# EAGLE design PiPowerRF (EAGLE 7.2.0)
CNAME: Arcturus Designs; CREVISION: 1.0; DESIGNER: Prajwal Bhattaram
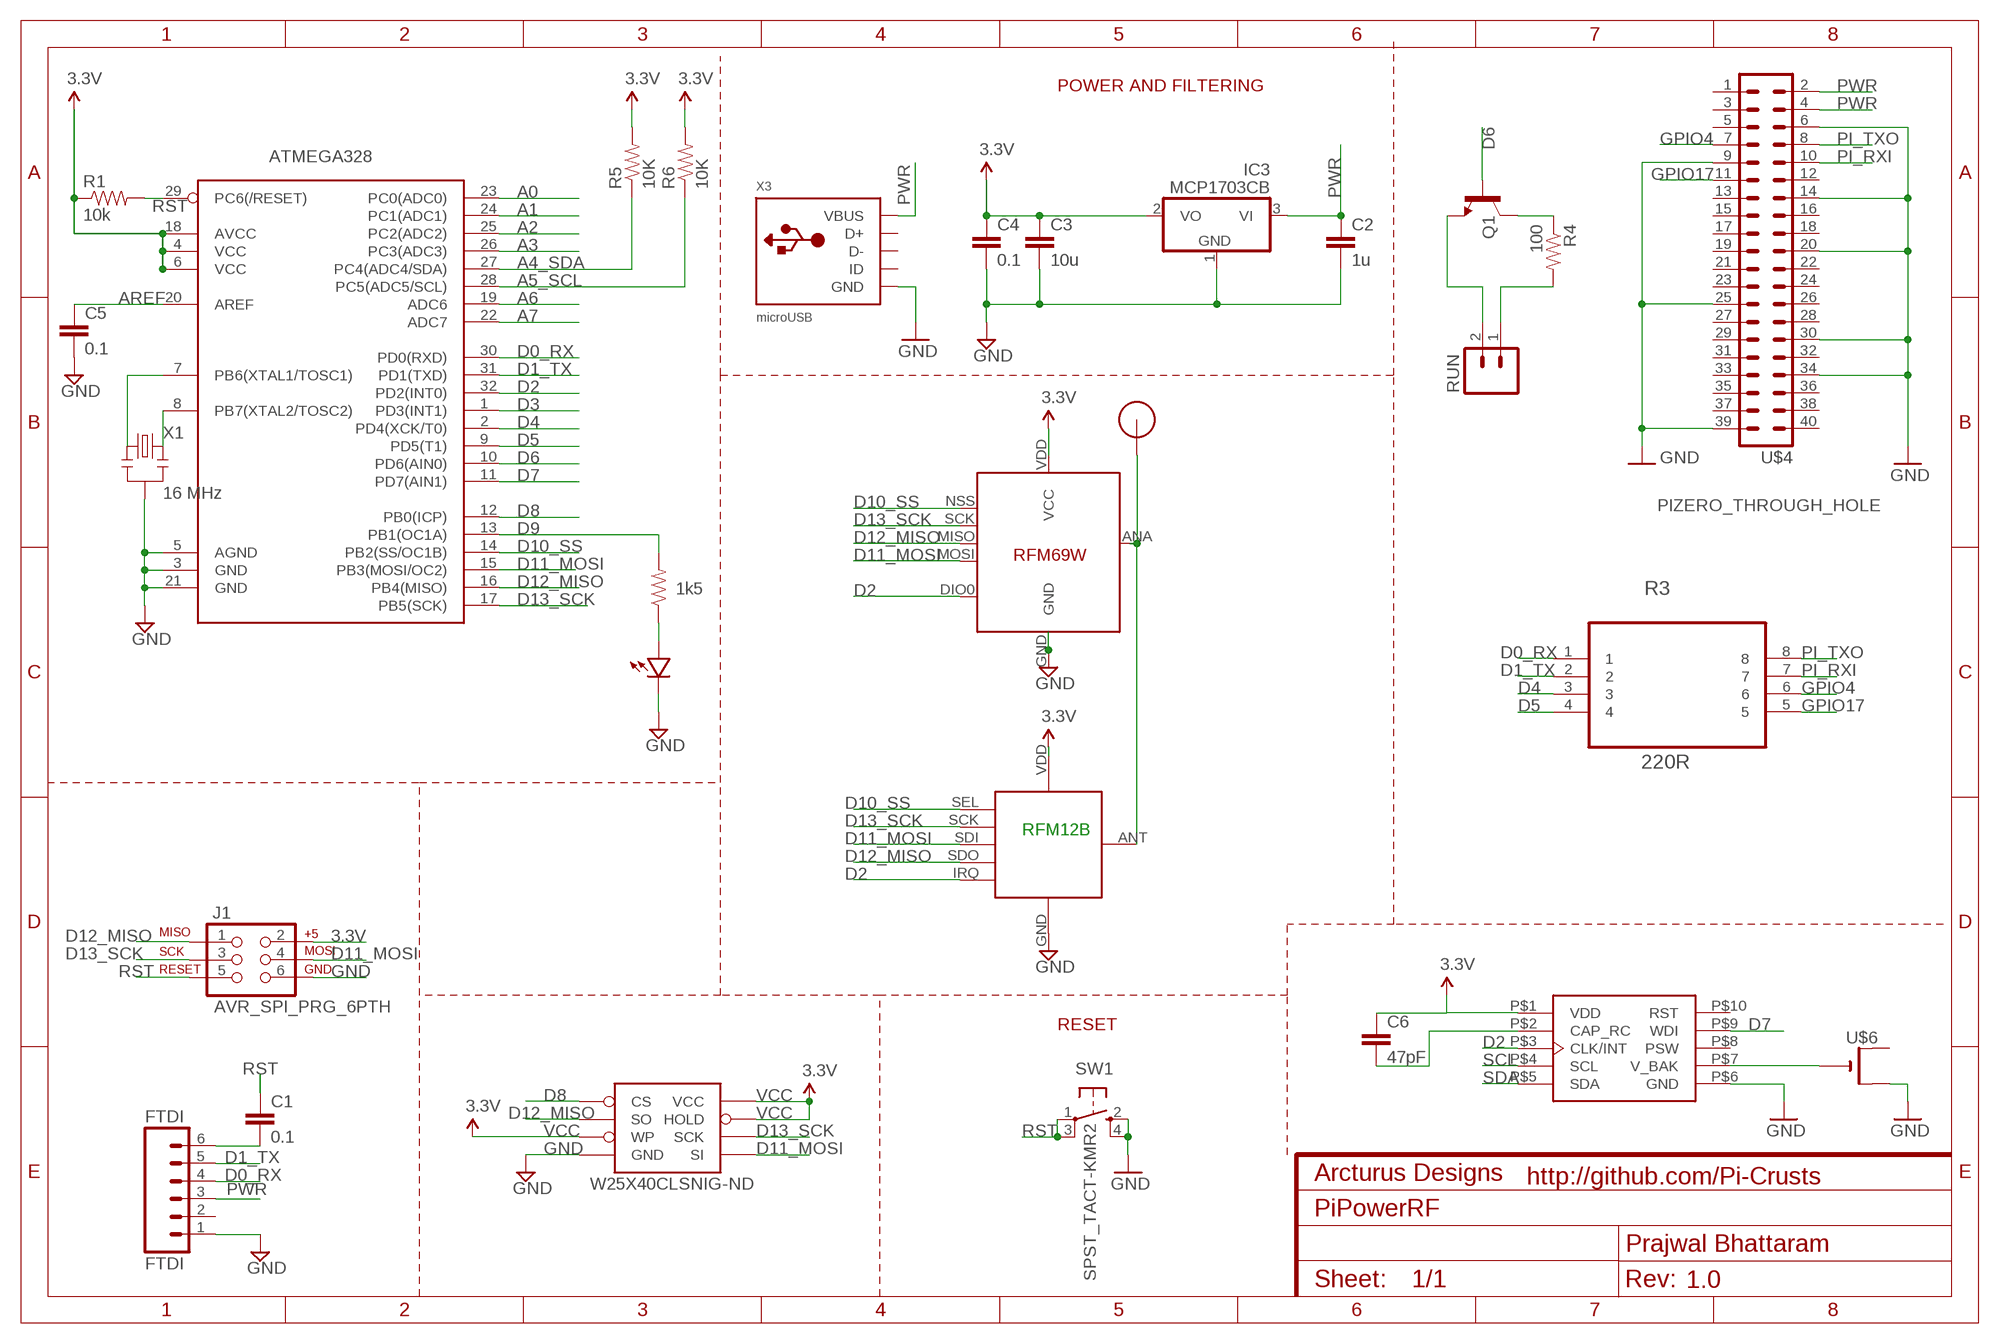
[diagram p0: schematic, sheet 1]

## Parts
ATMEGA328  ATMega-328  ATMEGA168/328TQFP32  [TQFP32-08]
C1  0.1  CAP0603-CAP  [0603-CAP]
C2  1u  CAP0603-CAP  [0603-CAP]
C3  10u  CAP0805-CAP  [0805-CAP]
C4  0.1  CAP0603-CAP  [0603-CAP]
C5  0.1  CAP0603-CAP  [0603-CAP]
C6  47pF  CAP0402-CAP  [0402-CAP]
FTDI  FTDI  M06SIP  [1X06]
IC3  MCP1703CB  [SOT23]
J1  AVR_SPI_PRG_6PTH  [2X3]
Q1  MMBT2222A  TRANSISTOR_NPNMMBT2222A  [SOT23-3]
R1  10k  RESISTOR0603-RES  [0603-RES]
R2  1k5  RESISTOR0603-RES  [0603-RES]
R3  220R  EXB38V221JV  [RESCAXE80P320X160X60-8N]
R4  100  RESISTOR0402-RES  [0402-RES]
R5  10K  RESISTOR0603  [0603-RES]
R6  10K  RESISTOR0603  [0603-RES]
RFM12B  RFM12B_MINPADS  [RFM12B-MINPADS]
RUN  M021X02_NO_SILK  [1X02_NO_SILK]
SW1  SPST_TACT-KMR2  [KMR2]
U$1  RFM12B_ANTENNA  [RFM12B-ANTENNA]
U$2  LED0603  [0603-LED]
U$4  PIZERO_THROUGH_HOLE  [PIZERO_THOUGH_HOLE]
U$5  RFM69  [RFM69W-MINPADS]
U$6  CR1220SMT  [CR1220-SMD]
W25X40CLSNIG-ND  AT25F512BWIDE_5.3MM  [SO08WIDE]
X1  16 MHz  RESONATORSMD  [RESONATOR-SMD]
X2  MC-RTC-RV-1805-C3-I2C  [MC-RTC-C3]
X3  microUSB  USB_MICRO_20329_V2  [4UCONN_20329_V2]

## Nets
3.3V: J1.2
A0: ATMEGA328.23(PC0(ADC0))
A1: ATMEGA328.24(PC1(ADC1))
A2: ATMEGA328.25(PC2(ADC2))
A3: ATMEGA328.26(PC3(ADC3))
A4_SDA: ATMEGA328.27(PC4(ADC4/SDA)) R5.1
A5_SCL: ATMEGA328.28(PC5(ADC5/SCL)) R6.1
A6: ATMEGA328.19(ADC6)
A7: ATMEGA328.22(ADC7)
AREF: ATMEGA328.20(AREF) C5.1
D0_RX: ATMEGA328.30(PD0(RXD)) FTDI.4 R3.1
D1_TX: ATMEGA328.31(PD1(TXD)) FTDI.5 R3.2
D2: ATMEGA328.32(PD2(INT0)) RFM12B.IRQ U$5.DIO0 X2.P$3(CLK/INT)
D3: ATMEGA328.1(PD3(INT1))
D4: ATMEGA328.2(PD4(XCK/T0)) R3.3
D5: ATMEGA328.9(PD5(T1)) R3.4
D6: ATMEGA328.10(PD6(AIN0)) Q1.1(B)
D7: ATMEGA328.11(PD7(AIN1)) X2.P$9(WDI)
D8: ATMEGA328.12(PB0(ICP)) W25X40CLSNIG-ND.1(CS)
D9: ATMEGA328.13(PB1(OC1A)) R2.2
D10_SS: ATMEGA328.14(PB2(SS/OC1B)) RFM12B.SEL U$5.NSS(SEL)
D11_MOSI: ATMEGA328.15(PB3(MOSI/OC2)) J1.4 RFM12B.SDI(SDI/MOSI) U$5.MOSI W25X40CLSNIG-ND.5(SI)
D12_MISO: ATMEGA328.16(PB4(MISO)) J1.1 RFM12B.SDO(SDO/MISO) U$5.MISO W25X40CLSNIG-ND.2(SO)
D13_SCK: ATMEGA328.17(PB5(SCK)) J1.3 RFM12B.SCK U$5.SCK W25X40CLSNIG-ND.6(SCK)
GND [power]: ATMEGA328.3(GND) ATMEGA328.5(AGND) ATMEGA328.21(GND) C2.2 C3.2 C4.2 C5.2 FTDI.1 IC3.1(GND) J1.6 RFM12B.GND SW1.2(S) SW1.4(S1) U$2.MINUS U$4.6 U$4.9 U$4.14 U$4.20 U$4.25 U$4.30 U$4.34 U$4.39 U$5.GND U$6.+$2(+1) W25X40CLSNIG-ND.4(GND) X1.2 X2.P$6(GND) X3.BASE@1(GND) X3.BASE@2(GND) X3.GND X3.SPRT@1(GND) X3.SPRT@2(GND) X3.SPRT@3(GND) X3.SPRT@4(GND)
GPIO4: R3.6 U$4.7
GPIO17: R3.5 U$4.11
N$1: ATMEGA328.7(PB6(XTAL1/TOSC1)) X1.1
N$2: R2.1 U$2.PLUS
N$3: RFM12B.ANT U$1.P$1 U$5.ANA(ANT)
N$4: R4.2 RUN.1
N$5: Q1.2(E) RUN.2
N$6: U$6.- X2.P$7(V_BAK)
N$7: Q1.3(C) R4.1
N$8: C6.2 X2.P$2(CAP_RC)
N$20: C1.2 FTDI.6
N$21: ATMEGA328.8(PB7(XTAL2/TOSC2)) X1.3
PI_RXI: R3.7 U$4.10
PI_TXO: R3.8 U$4.8
PWR [power]: C2.1 FTDI.3 IC3.3(VI) U$4.2 U$4.4 X3.VBUS
RST: ATMEGA328.29(PC6(/RESET)) C1.1 J1.5 R1.2 SW1.1(P) SW1.3(P1)
SCL: X2.P$4(SCL)
SDA: X2.P$5(SDA)
VCC: ATMEGA328.4(VCC) ATMEGA328.6(VCC) ATMEGA328.18(AVCC) C3.1 C4.1 C6.1 IC3.2(VO) R1.1 R5.2 R6.2 RFM12B.VDD U$5.VDD(VCC) W25X40CLSNIG-ND.3(WP) W25X40CLSNIG-ND.7(HOLD) W25X40CLSNIG-ND.8(VCC) X2.P$1(VDD) ; supply symbol labelled 3.3V
Unconnected: FTDI.2 U$4.1 U$4.3 U$4.5 U$4.12 U$4.13 U$4.15 U$4.16 U$4.17 U$4.18 U$4.19 U$4.21 U$4.22 U$4.23 U$4.24 U$4.26 U$4.27 U$4.28 U$4.29 U$4.31 U$4.32 U$4.33 U$4.35 U$4.36 U$4.37 U$4.38 U$4.40 U$6.+$1(+) X2.P$8(PSW) X2.P$10(RST) X3.D+ X3.D- X3.ID

## Notes on the sheet
- POWER AND FILTERING
- RFM12B
- RESET
- http://github.com/Pi-Crusts

## Library data of the parts
ATMEGA328 = LowPowerLab:ATMEGA168/328: Atmel 32-pin 8-bit micro, 16k flash.
C1-C5 = LowPowerLab:CAP: Capacitor Standard 0603 ceramic capacitor, and 0.1" leaded capacitor.
C6 = SparkFun-Capacitors:CAP: Capacitor Standard 0603 ceramic capacitor, and 0.1" leaded capacitor.
FTDI = SparkFun-Connectors:M06: Header 6 Standard 6-pin 0.1" header. Use with straight break away headers (SKU : PRT-00116), right angle break away headers (PRT-00553), swiss pins (PRT-00743), machine pins (PRT-00117), and female headers (PRT-00115). Molex polarized connector foot print use with SKU : PRT-08094 with associated crimp pins and housings. NOTES ON THE VARIANTS LOCK and LOCK_LONGPADS... This footprint was designed to help hold the alignment of a through-hole component (i.e. 6-pin header) while soldering it into place. You may notice that each hole has been shifted either up or down by 0.005 of an inch from it's more standard position (which is a perfectly straight line). This slight alteration caused the pins (the squares in the middle) to touch the edges of the holes. Because they are alternating, it causes a "brace" to hold the component in place. 0.005 has proven to be the perfect amount of "off-center" position when using our standard breakaway headers. Although looks a little odd when you look at the bare footprint, once you have a header in there, the alteration is very hard to notice. Also, if you push a header all the way into place, it is covered up entirely on the bottom side. This idea of altering the position of holes to aid alignment will be further integrated into the Sparkfun Library for other footprints. It can help hold any component with 3 or more connection pins.
IC3 = linear:MCP1703: 250 mA, 16V, Low Quiescent Current LDO Regulator Source: http://ww1.microchip.com/downloads/en/DeviceDoc/22049b.pdf
J1 = SparkFun-Connectors:AVR_SPI_PRG_6: AVR ISP 6 Pin This is the reduced ISP connector for AVR programming. Common on Arduino. This footprint will take up less PCB space and can be used with a 10-pin to 6-pin adapter such as SKU: BOB-08508
Q1 = SparkFun-DiscreteSemi:TRANSISTOR_NPN: Generic NPN BJT MMBT2222A - TRANS-08049 (SOT-23, 1A 40V) MPSA42 - TRANS-09116 (SOT-23, 500mA 300V) MMBT5088LT1G - TRANS-11160 (SOT-23, 50 mA 30V); PROD_ID: TRANS-08049
R1 R2 = LowPowerLab:RESISTOR: Resistor Basic schematic elements and footprints for 0603, 1206, and PTH resistors.
R3 = Panasonic-EXB-ERJ:EXB38V: Chip Resistor Array; MPN: EXB38V221JV; OC_FARNELL: 2060094; OC_NEWARK: 65T9093; PACKAGE: 0603; POWERRATING: 0.063 W/element; SUPPLIER: PANASONIC; TOLERANCE: ±5 %
R4 = SparkFun-Passives:RESISTOR: Resistor Basic schematic elements and footprints for 0603, 1206, and PTH resistors.
R5 R6 = SparkFun-Resistors:RESISTOR: Resistor Basic schematic elements and footprints for 0603, 1206, and PTH resistors.
RFM12B = LowPowerLab:RFM12B_MINPADS
RUN = SparkFun-Connectors:M02: Standard 2-pin 0.1" header. Use with - straight break away headers ( PRT-00116) - right angle break away headers (PRT-00553) - swiss pins (PRT-00743) - machine pins (PRT-00117) - female headers (PRT-00115) Molex polarized connector foot print use with: PRT-08233 with associated crimp pins and housings. 2.54_SCREWTERM for use with PRT-10571. 3.5mm Screw Terminal footprints for PRT-08084 5mm Screw Terminal footprints for use with PRT-08433
SW1 = adafruit:SPST_TACT: SMT 6mm switch, EVQQ2 series http://www.ladyada.net/library/eagle
U$1 = LowPowerLab:RFM12B_ANTENNA
U$2 = LowPowerLab:LED
U$4 = pizero:PIZERO_THROUGH_HOLE
U$5 = LowPowerLab:RFM69
U$6 = adafruit:CR1220: CR1216/CR1220/CR1225 12mm 3V lithium coin cell Great for battery packup. Both SMT and THM holders. Note the THM package has the ground pads on both sides of the PCB so that the masks are the same - this reduces the cost
W25X40CLSNIG-ND = LowPowerLab:AT25F512B: 4-Mbit SPI flash memory
X1 = SparkFun:RESONATOR: Resonator Small SMD resonator. This is the itty bitty 10/20MHz resonators with built in caps. CSTCE10M0G55 and CSTCE20M0V53. Footprint has been reviewed closely but hasn't been tested yet.
X2 = Microcrystal-RTC:MC-RTC-RV-1805-C3-I2C: MicroCrystal RV-1805-C3 Extreme Low Power RTC Module Extreme Low Current consumption XTAL-Mode 60nA RC-Mode 17nA RC Autocalibrated Mode 22nA Factory calibrated Time accuracy typ. ±2.0ppm @ 25°C Miniature SMT ceramic package with integrated Quartz Crystal for best Noise & EMI Immunity Automatic Battery Switchover, Trickle Charger, Power Management & Power Switch Function Programmable CLKOUT frequencies I2C Bus Interface (fast mode 400kHz) Time keeping mode down to 1.5 V Programmable Alarm, Timer and INT 512 Bytes of User RAM
X3 = microbuilder:USB: USB Connectors USBMINIB - Surface Mount Female Mini-B USB Connector 4UConnector: 06564

## Net classes
1 power: width 0.381 mm, clearance 0.254 mm

## Board
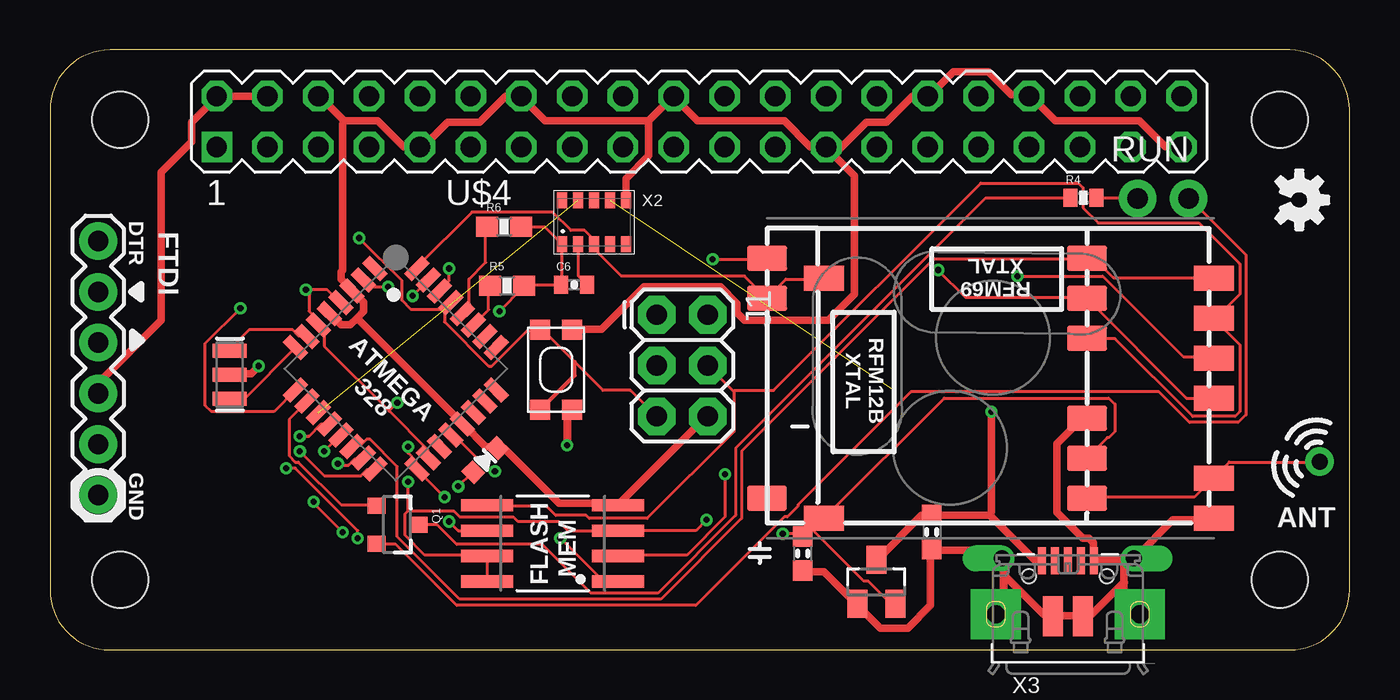
[diagram p1: board, top side]
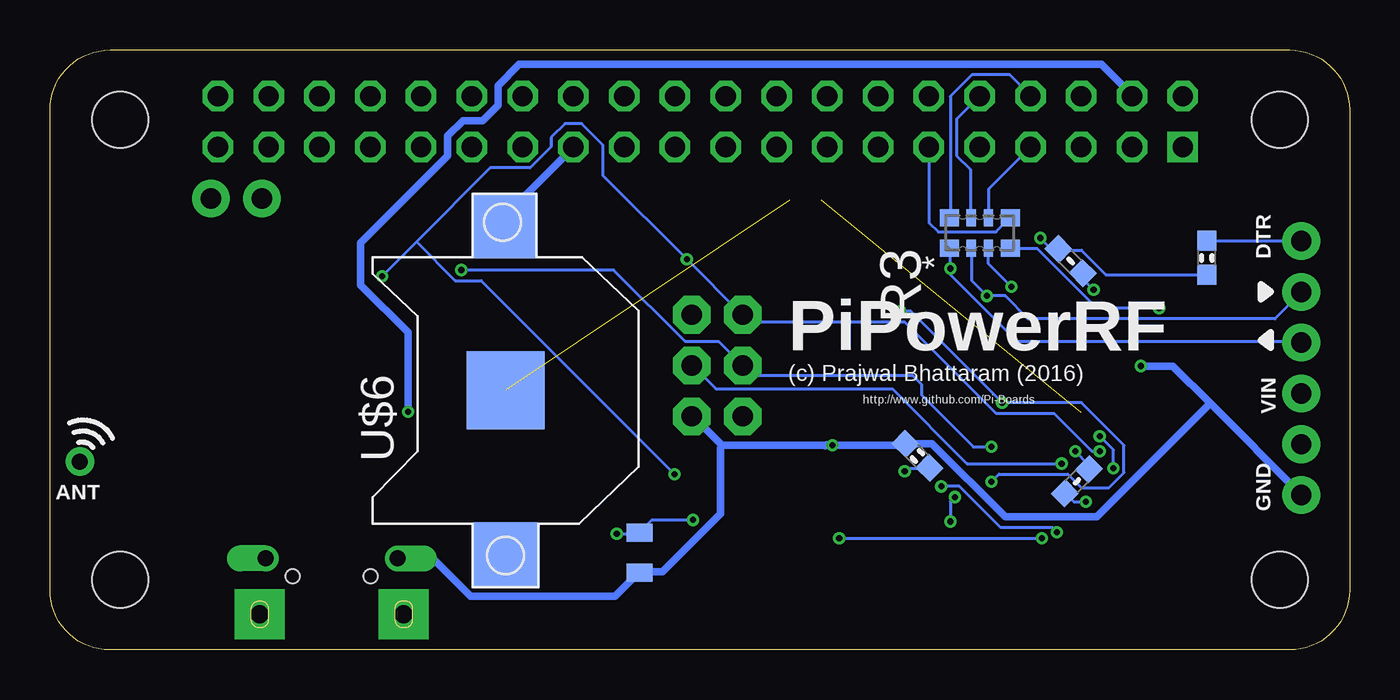
[diagram p2: board, bottom side, seen from below]

Size 65 x 30 mm. Coordinates in mm from the lower left corner, seen from the top.
Copper layers (1*16): Top 0.035mm / dielectric 1.5mm / Bottom 0.035mm
Design rules "ITEADstudio_DRC *": minimum track width 6mil, minimum drill 12mil, track to track 6mil, track to pad 6mil, pad to pad 6mil, via to via 6mil, smd to smd 0mil, copper to edge 10mil, drill to drill 10mil, minimum pad ring 10mil, minimum via ring 6mil, stop-mask expansion 2mil, vias tented up to drill 100mil, thermal gap 15mil
tRestrict: area 24.2,8.9 to 29,12.9; area 5.8,16.9 to 6.8,18.6; area 5.1,9.7 to 6.7,10.4
bRestrict: area 27.4,17.7 to 29.1,18.7; area 21,13.9 to 22.8,14.9; area 21.5,12.6 to 22,13.2; area 20.6,12.6 to 21.1,13.2; area 20.1,12.9 to 20.6,13.5; area 20,13.4 to 20.5,14.1; area 26.5,18.9 to 27,19.5; area 26.5,17.9 to 27,18.5; area 27.5,19.2 to 28,19.8; area 27.9,18.8 to 29,19.6

### Footprints (pad centres in the part's own frame; a part is rotated, then mirrored left to right if it is on the bottom)
TQFP32-08 = smd 1.27 x 0.533: 1 -4.293,2.8; 2 -4.293,2; 3 -4.293,1.2; 4 -4.293,0.4; 5 -4.293,-0.4; 6 -4.293,-1.2; 7 -4.293,-2; 8 -4.293,-2.8; 17 4.293,-2.8; 18 4.293,-2; 19 4.293,-1.2; 20 4.293,-0.4; 21 4.293,0.4; 22 4.293,1.2; 23 4.293,2; 24 4.293,2.8 | smd 0.533 x 1.27: 9 -2.8,-4.293; 10 -2,-4.293; 11 -1.2,-4.293; 12 -0.4,-4.293; 13 0.4,-4.293; 14 1.2,-4.293; 15 2,-4.293; 16 2.8,-4.293; 25 2.8,4.293; 26 2,4.293; 27 1.2,4.293; 28 0.4,4.293; 29 -0.4,4.293; 30 -1.2,4.293; 31 -2,4.293; 32 -2.8,4.293
0603-CAP = smd 1.016 x 0.965: 1 -0.85,0; 2 0.85,0
0805-CAP = smd 0.902 x 1.3: 1 -1,0; 2 1,0
0402-CAP = smd 0.7 x 0.9: 1 -0.65,0; 2 0.65,0
1X06 = drill 1.016 pad 1.88: 1 0,0; 2 2.54,0; 3 5.08,0; 4 7.62,0; 5 10.16,0; 6 12.7,0
SOT23 = smd 1 x 1.4: 1 -0.95,-1.1; 2 0.95,-1.1; 3 0,1.1
2X3 = drill 1.016 pad 1.88 octagon: 1 0,0; 2 0,2.54; 3 2.54,0; 4 2.54,2.54; 5 5.08,0; 6 5.08,2.54
SOT23-3 = smd 0.8 x 0.9: 1 -0.95,-1; 2 0.95,-1; 3 0,1.1
0603-RES = smd 1.016 x 0.965: 1 -0.85,0; 2 0.85,0
RESCAXE80P320X160X60-8N = smd 0.864 x 0.965: 1 -0.762,1.524; 4 -0.762,-1.524; 5 0.762,-1.524; 8 0.762,1.524 | smd 0.864 x 0.457: 2 -0.762,0.432; 3 -0.762,-0.432; 6 0.762,-0.432; 7 0.762,0.432
0402-RES = smd 0.7 x 0.9: 1 -0.65,0; 2 0.65,0
0603-RES' = smd 1.1 x 1: 1 -0.85,0; 2 0.85,0
RFM12B-MINPADS = smd 2 x 1.27: ANT 8,-6; GND 8,-2; IRQ -8,4; SCK 8,4; SDI 8,2; SDI1 -8.002,-6.001; SDO -8,6; SEL 8,6; VDD 8,-4
1X02_NO_SILK = drill 1.016 pad 1.88: 1 0,0; 2 2.54,0
KMR2 = smd 1 x 1: 1 2,0.8; 2 2,-0.8; 3 -2,0.8; 4 -2,-0.8
RFM12B-ANTENNA = drill 0.8 pad 1.422: P$1 0,0
0603-LED = smd 0.8 x 0.9: MINUS -0.85,0; PLUS 0.85,0
PIZERO_THOUGH_HOLE = drill 1.016 square: 1 8.34,25.15 | drill 1.016 octagon: 2 8.34,27.69; 3 10.88,25.15; 4 10.88,27.69; 5 13.42,25.15; 6 13.42,27.69; 7 15.96,25.15; 8 15.96,27.69; 9 18.5,25.15; 10 18.5,27.69; 11 21.04,25.15; 12 21.04,27.69; 13 23.58,25.15; 14 23.58,27.69; 15 26.12,25.15; 16 26.12,27.69; 17 28.66,25.15; 18 28.66,27.69; 19 31.2,25.15; 20 31.2,27.69; 21 33.74,25.15; 22 33.74,27.69; 23 36.28,25.15; 24 36.28,27.69; 25 38.82,25.15; 26 38.82,27.69; 27 41.36,25.15; 28 41.36,27.69; 29 43.9,25.15; 30 43.9,27.69; 31 46.44,25.15; 32 46.44,27.69; 33 48.98,25.15; 34 48.98,27.69; 35 51.52,25.15; 36 51.52,27.69; 37 54.06,25.15; 38 54.06,27.69; 39 56.6,25.15; 40 56.6,27.69 | hole 2.8: 3.5,3.5; 3.5,26.5; 61.5,26.5; 61.5,3.5
RFM69W-MINPADS = smd 2 x 1.27: ANA 8,-5; DIO0 -11.5,5; GND 8,-7; MISO 8,1; MOSI 8,3; NSS 8,5; SCK 8,-1; VDD -11.5,-7
CR1220-SMD = smd 3.2 x 3.2: +$1 -8.2,0; +$2 8.2,0 | smd 3.9 x 3.9: - 0,0
SO08WIDE = smd 0.61 x 2.6: 1 -1.905,-3.269; 2 -0.635,-3.269; 3 0.635,-3.269; 4 1.905,-3.269; 5 1.905,3.286; 6 0.635,3.286; 7 -0.635,3.286; 8 -1.905,3.286
RESONATOR-SMD = smd 0.7 x 1.7: 1 -1.2,0; 2 0,0; 3 1.2,0
MC-RTC-C3 = smd 0.5 x 0.8: P$1 -1.6,-1.1; P$2 -0.8,-1.1; P$3 0,-1.1; P$4 0.8,-1.1; P$5 1.6,-1.1; P$6 1.6,1.1; P$7 0.8,1.1; P$8 0,1.1; P$9 -0.8,1.1; P$10 -1.6,1.1
4UCONN_20329_V2 = smd 1 x 2: BASE@1 -0.75,-2; BASE@2 0.75,-2 | smd 0.4 x 1.35: D+ 0,0.775; D- -0.65,0.775; GND 1.3,0.775; ID 0.65,0.775; VBUS -1.3,0.775 | drill 0.8 pad 1.2 offset: SPRT@1 -3.3,0.9; SPRT@2 3.3,0.9 | drill 0.9 pad 2.5 square: SPRT@3 -3.6,-1.9; SPRT@4 3.6,-1.9 | hole 0.7: -1.95,0; 1.95,0

### Placement (x,y rotation side)
ATMEGA328  17.3,14.06 315 top
C1  7.14,19.61 90 bottom
C2  44.09,5.89 270 top
C3  35.51,4.85 270 bottom
C4  37.64,4.83 270 top
C5  21.62,9.7 135 bottom
C6  26.21,18.26 0 top
FTDI  2.41,7.75 90 top
IC3  41.33,3.4 0 top
J1  30.35,16.76 270 top
Q1  17.35,6.27 270 top
R1  13.95,19.45 135 bottom
R2  13.64,8.43 45 bottom
R3  18.49,20.85 90 bottom
R4  51.69,22.61 0 top
R5  10K  [0603-RES']  22.86,18.21 0 top
R6  10K  [0603-RES']  22.71,21.16 0 top
RFM12B  43.87,13.59 0 top
RUN  54.41,22.58 0 top
SW1  25.32,14.02 90 top
U$1  63.51,9.42 340 bottom
U$2  21.77,9.5 225 top
U$3  [OSHW-LOGO-S]  62.48,22.5 270 top
U$4  0,0 0 top
U$5  50.22,13.59 0 top
U$6  42.21,12.98 90 bottom
W25X40CLSNIG-ND  25.15,5.33 90 top
X1  8.99,13.77 270 top
X2  27.2,21.39 0 top
X3  50.9,3.68 0 top

### Tracks (layer width: path | path; a pad name or v marks a point on that pad's centre or on a via)
A4_SDA
  Top 0.152: R5.1 21.95,18.16 21.95,17.02 21.18,16.26 ATMEGA328.27
A5_SCL
  Top 0.152: R6.1 21.79,21.13 21.79,19.38 20.95,18.54 20.95,17.17 20.65,16.87 ATMEGA328.28
AREF  (via drill 0.3)
  Top 0.152: v22.25,8.94 22.02,8.94 20.27,10.69 20.12,10.69 ATMEGA328.20
  Bottom 0.152: v22.25,8.94 22.1,9.09 21.03,9.09 C5.1
D0_RX  (via drill 0.3)
  Top 0.152: v19.96,19.08 19.96,18.47 19.51,18.01 ATMEGA328.30
  Bottom 0.152: R3.1 19.96,20.07 v19.96,19.08 19.96,18.77 16.61,15.42 2.44,15.42 FTDI.4
D1_TX  (via drill 0.3)
  Top 0.152: v18.14,17.7 18.9,18.47 ATMEGA328.31
  Bottom 0.152: R3.2 18.9,20.07 18.9,18.47 v18.14,17.7 17.22,17.7 16.08,16.56 3.73,16.56 2.44,17.86 FTDI.5
D2
  Top 0.152: ATMEGA328.32 18.36,19.15 21.11,21.89 25.15,21.89 26.06,20.98 26.75,20.98 27.2,20.52 X2.P$3 27.2,20.07 28.57,18.69 34.75,18.69 35.81,17.63 RFM12B.IRQ 35.89,17.63 36.8,18.54 38.71,18.54 U$5.DIO0
D4  (via drill 0.3)
  Top 0.152: v16.92,18.16 16,18.16 15.7,18.47 ATMEGA328.2
  Bottom 0.152: R3.3 18.06,19.3 v16.92,18.16
D5  (via drill 0.3)
  Top 0.152: v9.52,17.09 7.77,15.34 7.77,12.22 8.08,11.91 11.2,11.91 12.27,12.98 ATMEGA328.9
  Bottom 0.152: v9.52,17.09 12.65,17.09 15.62,20.07 16.92,20.07 R3.4
D6
  Top 0.152: Q1.1 16.31,7.26 14.55,7.26 12.42,9.4 12.27,9.4 11.96,9.7 11.96,11.53 12.8,12.37 ATMEGA328.10
D7  (1 unrouted)
D8  (via drill 0.3)
  Top 0.152: v12.5,10.69 12.95,10.69 13.56,11.3 13.94,11.3 ATMEGA328.12 | v11.81,9.09 12.27,9.09 15.39,5.97 v15.39,5.59 | v25.53,5.59 27.66,3.45 28.35,3.45 W25X40CLSNIG-ND.1
  Bottom 0.152: v12.5,10.69 11.81,10.01 v11.81,9.09 | v25.53,5.59 v15.39,5.59
D9  (via drill 0.3)
  Top 0.152: v13.72,9.93 14.48,10.69 ATMEGA328.13
  Bottom 0.152: v13.72,9.93 13.11,9.32 13.11,9.09 R2.2
D10_SS
  Top 0.152: ATMEGA328.14 15.16,10.24 15.54,10.24 15.85,10.54 16,10.54 17.37,9.17 17.37,5.66 20.5,2.54 30.56,2.54 34.59,6.58 34.59,9.93 44.2,19.53 51.82,19.53 RFM12B.SEL 51.89,19.53 52.27,19.53 53.19,18.62 58.14,18.62 U$5.NSS
D11_MOSI  (via drill 0.3)
  Top 0.152: RFM12B.SDI 51.89,15.57 53.26,15.57 57.15,11.68 59.28,11.68 59.51,11.91 59.51,15.27 58.22,16.56 U$5.MOSI 58.29,16.56 59.51,17.78 59.51,19.3 57.45,21.36 52.43,21.36 51.66,22.12 51.66,23.11 51.43,23.34 46.56,23.34 36.19,12.98 34.21,12.98 34.18,12.94 | v14.4,9.32 14.48,9.25 14.93,9.25 15.24,9.55 15.62,9.55 ATMEGA328.15 | J1.4 34.18,12.94 | 34.18,12.94 34.21,12.9 34.21,10.92 29.87,6.58 26.97,6.58 26.82,6.73 25.3,6.73 24.84,7.19 21.87,7.19 W25X40CLSNIG-ND.5
  Bottom 0.152: v14.4,9.32 19.13,9.32 22.86,13.06 31.7,13.06 32.84,14.2 J1.4
D12_MISO  (via drill 0.3)
  Top 0.152: v12.5,9.93 13.72,8.71 15.54,8.71 15.85,9.02 16.23,9.02 ATMEGA328.16 | v33.15,19.53 35.81,19.53 RFM12B.SDO | v48.39,18.69 52.65,18.69 56.69,14.66 58.14,14.66 U$5.MISO | v33.76,8.79 33.76,6.65 31.85,4.75 28.42,4.75 W25X40CLSNIG-ND.2
  Bottom 0.152: v12.5,9.93 12.88,9.93 14.78,11.84 17.68,11.84 22.25,16.41 30.02,16.41 30.33,16.71 J1.1 30.4,16.79 v33.15,19.53 37.34,23.72 37.34,25.25 38.4,26.31 39.24,26.31 39.93,25.63 39.93,25.17 41,24.1 42.98,24.1 46.67,20.41 | 46.67,20.41 v48.39,18.69 | v33.76,8.79 43.43,18.47 44.73,18.47 46.67,20.41
D13_SCK  (via drill 0.3)
  Top 0.152: U$5.SCK 58.14,12.6 56.84,12.6 51.89,17.55 RFM12B.SCK 51.82,17.63 45.8,17.63 v44.42,19 | v17.91,10.16 17.91,9.86 18.29,9.47 18.29,9.09 ATMEGA328.17 18.36,9.02 v19.74,7.65 | W25X40CLSNIG-ND.6 20.42,5.97 v19.96,6.43
  Bottom 0.152: v17.91,10.16 18.82,10.16 21.41,12.75 21.41,13.28 21.87,13.74 29.87,13.74 J1.3 31.55,15.42 33.22,15.42 36.8,19 v44.42,19 | v19.96,6.43 19.96,7.42 v19.74,7.65
GND  (via drill 0.3)
  Top 0.381: SW1.2 26.14,16.03 27.58,16.03 29.72,18.16 33.53,18.16 34.37,17.32 34.37,16.87 34.75,16.48 38.94,16.48 40.23,17.78 40.23,23.72 38.86,25.1 U$4.25 | U$4.25 39.32,24.87 40.84,26.39 41.83,26.39 43.13,27.69 43.89,27.69 U$4.30 44.04,27.76 45.19,28.91 46.94,28.91 48.08,27.76 48.92,27.76 U$4.34 49.15,27.61 50.29,26.47 54.48,26.47 55.78,25.17 56.54,25.17 U$4.39 | C4.2 37.64,3.91 38.71,3.91 40.31,2.31 IC3.1 40.46,2.16 41.53,1.09 42.9,1.09 44.04,2.24 44.04,4.83 C2.2 44.12,4.98 47.17,4.98 47.55,4.6 X3.SPRT@1 47.7,4.45 47.7,3.94 47.7,3.76 49.68,1.78 49.99,1.78 X3.BASE@1 50.22,1.7 51.59,1.7 X3.BASE@2 51.82,1.78 52.12,1.78 53.72,3.38 53.72,4.37 X3.SPRT@2 | U$5.GND 58.06,6.5 56.16,6.5 54.33,4.67 X3.SPRT@2 | X3.SPRT@2 54.18,4.52 52.27,4.52 X3.GND 52.2,4.67 52.2,5.36 51.97,5.59 51.66,5.59 50.37,6.88 50.37,10.31 51.59,11.53 51.82,11.53 RFM12B.GND | 29.95,26.47 29.95,24.71 28.8,23.57 28.8,22.5 X2.P$6 | 29.95,26.47 31.17,27.69 U$4.20 31.32,27.53 32.38,26.47 36.73,26.47 38.02,25.17 38.63,25.17 U$4.25 | 14.71,26.47 16.38,26.47 17.68,25.17 18.44,25.17 U$4.9 18.67,25.17 19.89,26.39 21.49,26.39 22.78,27.69 23.55,27.69 U$4.14 23.7,27.53 24.76,26.47 29.95,26.47 | 14.71,26.47 13.49,27.69 U$4.6 | v10.44,14.2 10.06,13.82 8.99,13.82 X1.2 | 15.35,16.6 15.7,16.94 15.7,17.4 15.16,17.93 ATMEGA328.3 15.01,18.08 14.55,18.54 14.55,18.92 14.63,19 14.63,26.31 14.71,26.47 | 15.35,16.6 15.01,16.26 14.55,16.26 14.02,16.79 ATMEGA328.5 | 15.35,16.6 20.5,11.46 ATMEGA328.21 20.65,11.3 21.79,10.16 22.33,10.16 U$2.MINUS 22.55,10.08 22.71,10.08 25.45,7.34 28.27,7.34 W25X40CLSNIG-ND.4 28.42,7.26 32.84,11.68 J1.6
  Top 0.406: X3.SPRT@3 47.7,2.18 47.7,3.94 | X3.SPRT@4 53.72,2.56 53.72,3.38 | SW1.4 25.86,11.75 v25.86,10.24
  Bottom 0.381: U$6.+$2 42.21,21.74 38.86,25.1 U$4.25 | v10.44,14.2 8.84,14.2 6.97,12.33 | 6.97,12.33 2.44,7.8 FTDI.1 | 31.39,10.24 26.21,10.24 | v25.86,10.24 22.25,10.24 C5.2 22.02,10.31 20.88,10.31 17.22,6.65 12.65,6.65 6.97,12.33 | 31.39,10.24 32.84,11.68 J1.6 | 31.39,10.24 31.47,10.08 31.47,6.81 34.37,3.91 35.51,3.91 C3.2 35.66,3.76 36.73,2.69 43.97,2.69 45.8,4.52 47.55,4.52 X3.SPRT@1
  Bottom 0.406: v25.86,10.24 26.21,10.24
GPIO4
  Bottom 0.152: R3.6 18.06,23.04 16,25.1 U$4.7
GPIO17
  Bottom 0.152: R3.5 17.68,20.9 20.57,20.9 21.03,21.36 21.03,25.1 U$4.11
N$1
  Top 0.152: ATMEGA328.7 12.8,15.72 12.42,15.72 12.12,16.03 9.98,16.03 8.99,15.04 X1.1
N$2  (via drill 0.3)
  Top 0.152: v20.42,8.18 21.11,8.86 U$2.PLUS | v14.63,5.89 13.18,7.34 v13.18,7.42
  Bottom 0.152: v20.42,8.18 19.51,8.18 17.45,6.12 14.86,6.12 v14.63,5.89 | v13.18,7.42 13.79,7.42 14.17,7.8 R2.1
N$3
  Top 0.152: RFM12B.ANT 51.89,7.65 57.23,7.65 58.14,8.56 U$5.ANA 58.22,8.64 58.98,9.4 63.47,9.4 U$1.P$1
N$4
  Top 0.152: RUN.1 52.35,22.58 R4.2
N$5
  Top 0.152: Q1.2 16.38,5.28 17.3,5.28 20.35,2.24 32.31,2.24 36.73,6.65 36.88,6.65 37.41,7.19 37.41,7.26 43.05,12.9 55.47,12.9 57,11.38 59.44,11.38 59.82,11.76 59.82,19.76 57,22.58 RUN.2
N$6  (1 unrouted)
N$7
  Top 0.152: Q1.3 19.35,6.27 20.35,5.28 24.61,5.28 27.05,2.84 30.4,2.84 34.29,6.73 34.29,10.08 46.79,22.58 50.98,22.58 R4.1
N$8
  Top 0.152: X2.P$2 26.44,20.22 26.44,18.69 26.82,18.31 C6.2
N$20
  Bottom 0.152: FTDI.6 7.09,20.45 C1.2
N$21
  Top 0.152: ATMEGA328.8 12.27,15.11 9.75,12.6 8.99,12.6 X1.3
PI_RXI
  Bottom 0.152: R3.7 18.97,21.67 18.97,24.03 19.66,24.71 19.66,26.54 18.52,27.69 U$4.10
PI_TXO
  Bottom 0.152: R3.8 19.96,21.67 19.96,27.69 18.9,28.75 16.99,28.75 16,27.76 U$4.8
PWR  (via drill 0.3)
  Top 0.381: IC3.3 41.38,4.52 43.59,6.73 44.04,6.73 C2.1 44.27,6.73 47.02,6.73 | 47.02,6.73 49.22,4.52 49.53,4.52 X3.VBUS | U$4.4 10.82,27.69 8.38,27.69 U$4.2 8.23,27.53 7.09,26.39 7.09,25.4 5.56,23.88 5.56,16.48 2.44,13.36 2.44,12.83 FTDI.3 | v47.09,11.91 47.09,6.88 47.02,6.73
  Bottom 0.381: v47.09,11.91 47.09,15.88 49.45,18.24 49.45,20.37 45.11,24.71 45.11,25.7 44.35,26.47 43.36,26.47 42.6,27.23 42.6,28.22 41.53,29.29 12.42,29.29 10.9,27.76 U$4.4
RST  (via drill 0.3)
  Top 0.152: 19.74,17.02 19.74,16.41 21.95,14.2 22.1,14.2 23.85,15.95 24.46,15.95 SW1.1 24.54,15.95 24.69,15.95 26.24,14.4 27.66,12.98 29.03,12.98 30.33,11.68 J1.5 | 19.74,17.02 20.04,17.32 ATMEGA328.29 19.74,17.02 | v15.47,20.6 17.6,18.47 17.6,17.48 18.06,17.02 19.74,17.02
  Top 0.203: SW1.3 26.24,13.74 26.24,14.4
  Bottom 0.152: C1.1 7.16,18.77 12.19,18.77 13.41,19.99 14.48,19.99 R1.2 14.55,20.07 14.93,20.07 v15.47,20.6
VCC  (via drill 0.3)
  Top 0.152: R6.2 23.62,21.13 24.76,21.13 X2.P$1 25.6,20.22 25.6,18.31 C6.1 25.53,18.24 23.77,18.24 R5.2 23.7,18.16 v22.48,16.94 | 12.95,18.01 13.87,18.01 14.48,17.4 ATMEGA328.4 | 12.95,18.01 12.95,16.94 13.41,16.48 13.41,16.26 ATMEGA328.6 13.49,16.18 13.72,15.95 13.72,15.19 16.95,11.95 | 12.95,18.01 v12.8,18.01 | 16.95,11.95 18.9,10.01 18.9,9.63 ATMEGA328.18 | 16.95,11.95 v17.37,12.37 | W25X40CLSNIG-ND.8 21.87,3.45 21.87,4.67 W25X40CLSNIG-ND.7 21.79,4.75 18.74,4.75 17.75,5.74 17.75,6.81 17.91,6.96 | 17.91,6.96 20.19,6.96 20.5,6.65 23.16,6.65 23.39,6.43 25.45,6.43 25.91,5.97 W25X40CLSNIG-ND.3 32.31,5.97 v32.84,6.5 | 37.64,5.74 37.87,5.74 U$5.VDD | v36.65,5.82 37.57,5.82 37.64,5.74 | 37.64,5.74 C4.1 | IC3.2 42.21,2.31 42.06,2.31 40.92,3.45 40.69,3.45 38.18,5.97 U$5.VDD | RFM12B.VDD 51.89,9.63 52.88,10.62 52.96,10.62 53.26,10.92 53.26,12.29 52.96,12.6 44.73,12.6 38.79,6.65 U$5.VDD | 17.91,6.96 v17.91,8.41
  Bottom 0.152: v12.8,18.01 13.33,18.54 13.33,18.85 R1.1 | v22.48,16.94 21.95,16.94 v17.37,12.37 13.41,12.37 11.28,10.24 11.28,8.86 12.04,8.1 13.41,8.1 14.1,8.79 17.53,8.79 v17.91,8.41 | v36.65,5.82 35.51,5.82 C3.1 35.51,5.89 34.9,6.5 v32.84,6.5

### Text on the board
tPlace: RFM69 / XTAL | RFM12B / XTAL
tDocu: REG
_tsilk: DTR | FTDI | ATMEGA / 328 | GND | FLASH | MEM | ANT
_bsilk: DTR | PiPowerRF | (c) Prajwal Bhattaram (2016) | VIN | http://www.github.com/Pi-Boards | ANT | GND